# Altium schematic sheet EmgAcq.SchDoc: EMG ACQ-4
size A3
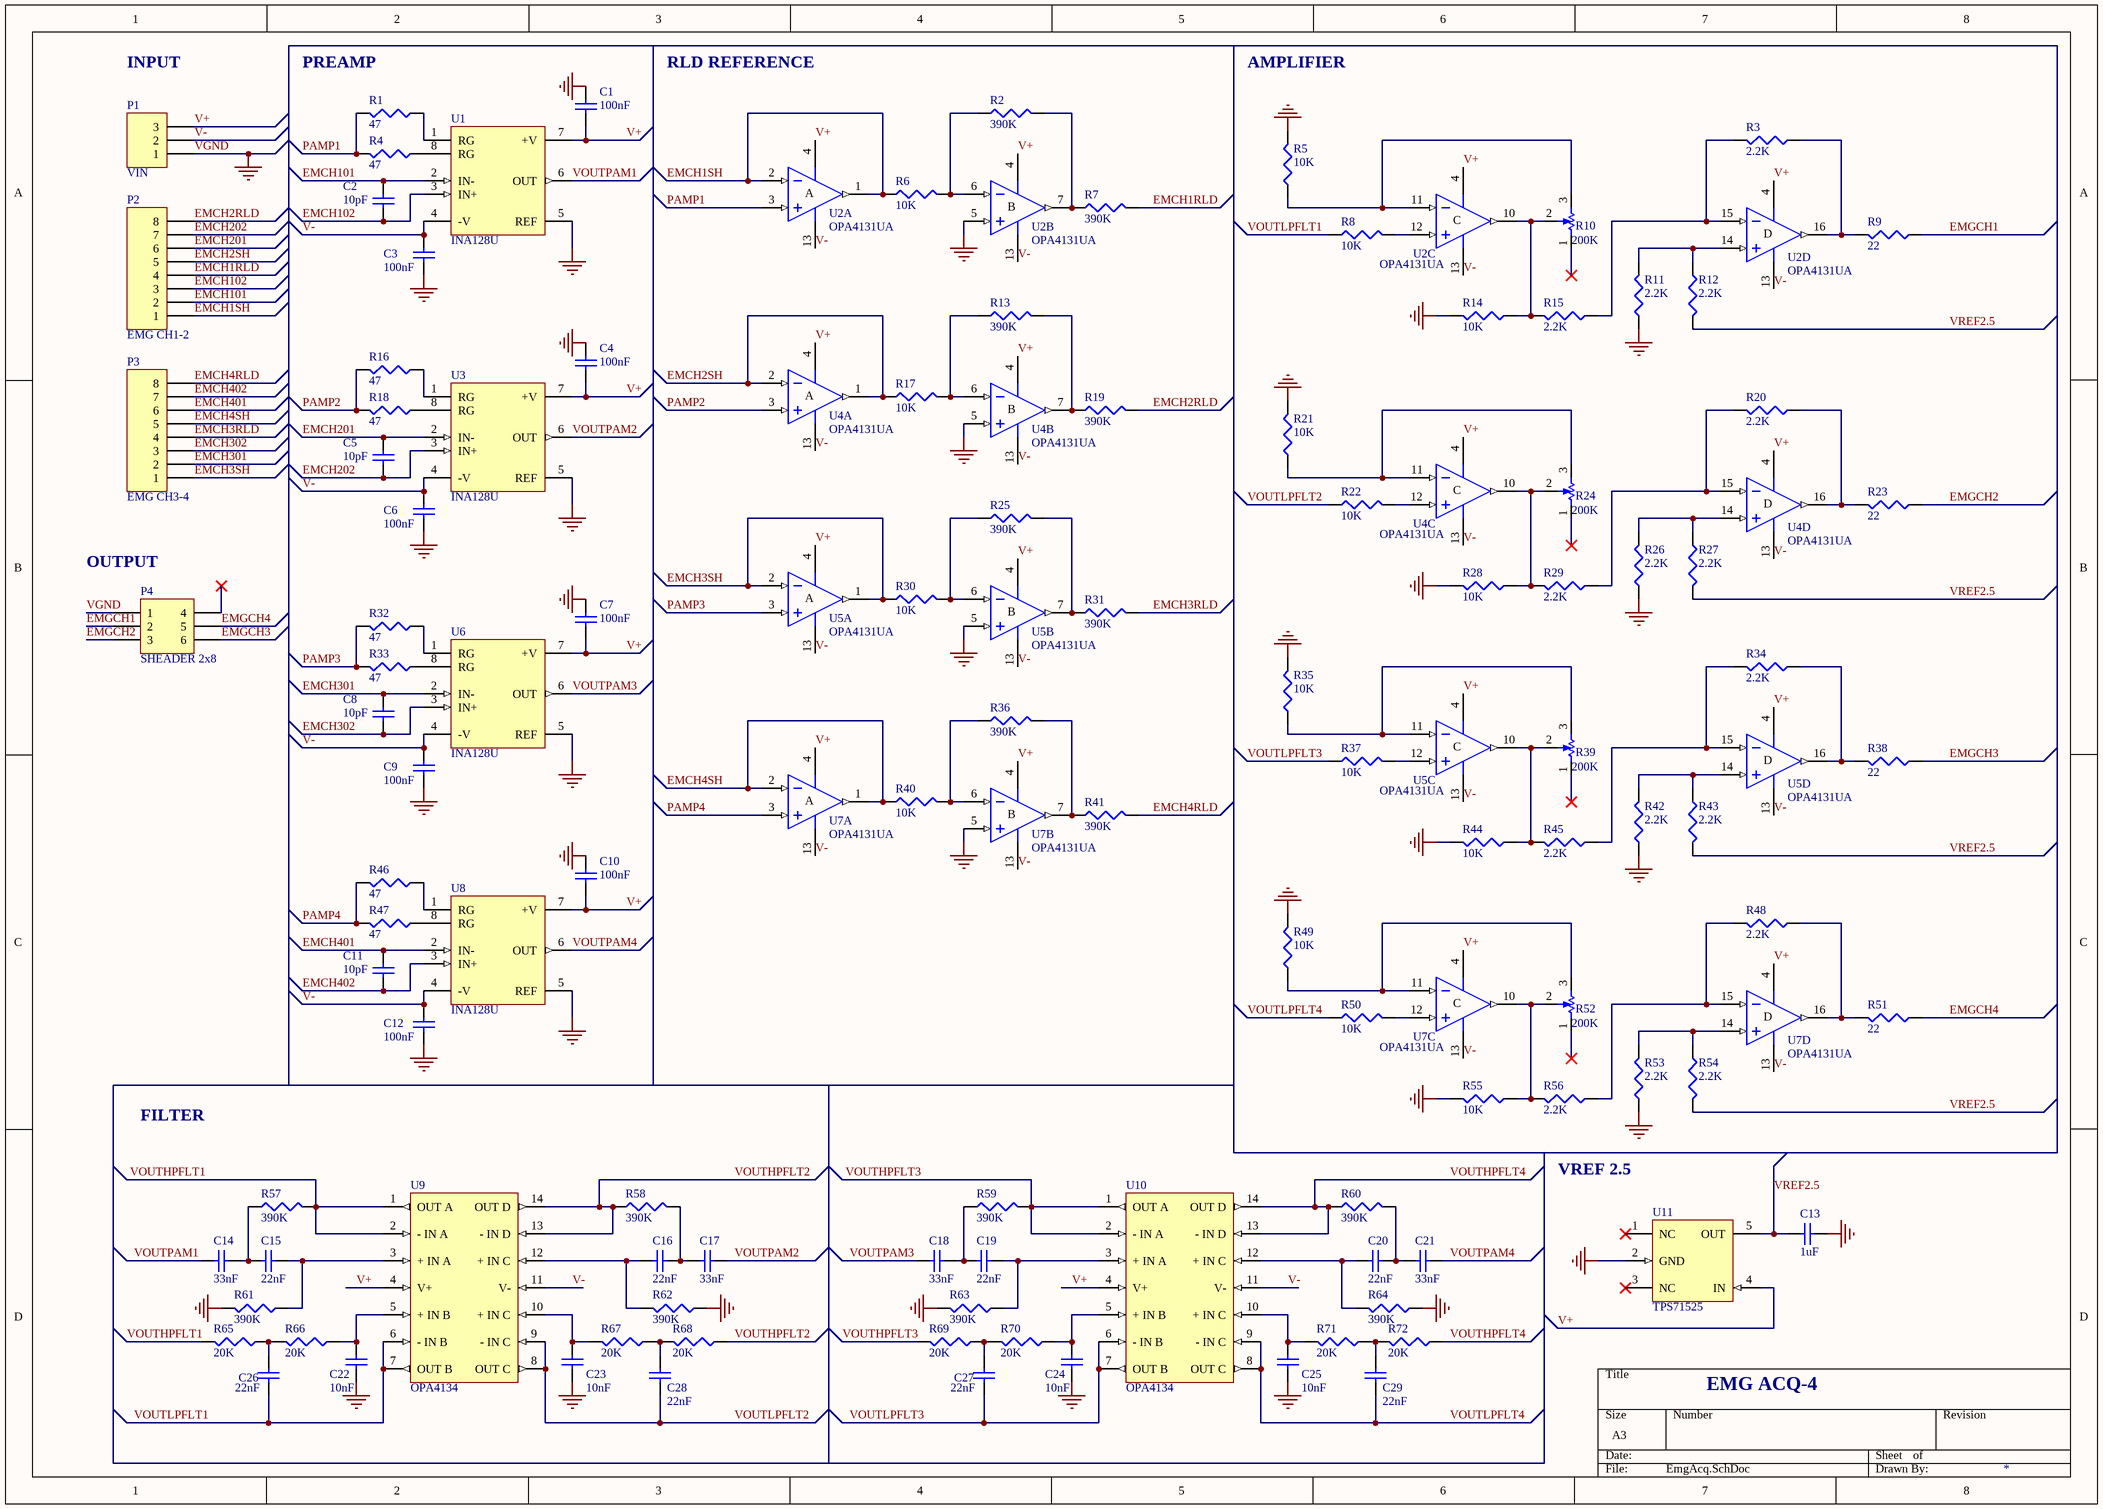
[diagram p0: EmgAcq.SchDoc]

## Parts
C1  value 100nF  [C1206]  (hidden comment: Cap Semi)
C2  value 10pF  [C1206]  (hidden comment: Cap Semi)
C3  value 100nF  [C1206]  (hidden comment: Cap Semi)
C4  value 100nF  [C1206]  (hidden comment: Cap Semi)
C5  value 10pF  [C1206]  (hidden comment: Cap Semi)
C6  value 100nF  [C1206]  (hidden comment: Cap Semi)
C7  value 100nF  [C1206]  (hidden comment: Cap Semi)
C8  value 10pF  [C1206]  (hidden comment: Cap Semi)
C9  value 100nF  [C1206]  (hidden comment: Cap Semi)
C10  value 100nF  [C1206]  (hidden comment: Cap Semi)
C11  value 10pF  [C1206]  (hidden comment: Cap Semi)
C12  value 100nF  [C1206]  (hidden comment: Cap Semi)
C13  value 1uF  [CAPC2012M]  (hidden comment: Cap Semi)
C14  value 33nF  [C1206]  (hidden comment: Cap Semi)
C15  value 22nF  [1608[0603]]  (hidden comment: Cap Semi)
C16  value 22nF  [1608[0603]]  (hidden comment: Cap Semi)
C17  value 33nF  [C1206]  (hidden comment: Cap Semi)
C18  value 33nF  [C1206]  (hidden comment: Cap Semi)
C19  value 22nF  [1608[0603]]  (hidden comment: Cap Semi)
C20  value 22nF  [1608[0603]]  (hidden comment: Cap Semi)
C21  value 33nF  [C1206]  (hidden comment: Cap Semi)
C22  value 10nF  [C1206]  (hidden comment: Cap Semi)
C23  value 10nF  [C1206]  (hidden comment: Cap Semi)
C24  value 10nF  [C1206]  (hidden comment: Cap Semi)
C25  value 10nF  [C1206]  (hidden comment: Cap Semi)
C26  value 22nF  [1608[0603]]  (hidden comment: Cap Semi)
C27  value 22nF  [1608[0603]]  (hidden comment: Cap Semi)
C28  value 22nF  [1608[0603]]  (hidden comment: Cap Semi)
C29  value 22nF  [1608[0603]]  (hidden comment: Cap Semi)
P1  VIN  [AZUL5-3]
P2  EMG CH1-2  [AZUL5-8]
P3  EMG CH3-4  [AZUL5-8]
P4  SHEADER 2x8  [SHBH 2x3]
R1  value 47  [RESC3225M]  (hidden comment: Res3)
R2  value 390K  [RESC3225M]  (hidden comment: Res3)
R3  value 2.2K  [RESC3225M]  (hidden comment: Res3)
R4  value 47  [RESC3225M]  (hidden comment: Res3)
R5  value 10K  [RESC3225M]  (hidden comment: Res3)
R6  value 10K  [RESC3225M]  (hidden comment: Res3)
R7  value 390K  [RESC3225M]  (hidden comment: Res3)
R8  value 10K  [RESC3225M]  (hidden comment: Res3)
R9  value 22  [RESC3225M]  (hidden comment: Res3)
R10  POT3361  [3361P]  (value not drawn)
R11  value 2.2K  [RESC3225M]  (hidden comment: Res3)
R12  value 2.2K  [RESC3225M]  (hidden comment: Res3)
R13  value 390K  [RESC3225M]  (hidden comment: Res3)
R14  value 10K  [RESC3225M]  (hidden comment: Res3)
R15  value 2.2K  [RESC3225M]  (hidden comment: Res3)
R16  value 47  [RESC3225M]  (hidden comment: Res3)
R17  value 10K  [RESC3225M]  (hidden comment: Res3)
R18  value 47  [RESC3225M]  (hidden comment: Res3)
R19  value 390K  [RESC3225M]  (hidden comment: Res3)
R20  value 2.2K  [RESC3225M]  (hidden comment: Res3)
R21  value 10K  [RESC3225M]  (hidden comment: Res3)
R22  value 10K  [RESC3225M]  (hidden comment: Res3)
R23  value 22  [RESC3225M]  (hidden comment: Res3)
R24  POT3361  [3361P]  (value not drawn)
R25  value 390K  [RESC3225M]  (hidden comment: Res3)
R26  value 2.2K  [RESC3225M]  (hidden comment: Res3)
R27  value 2.2K  [RESC3225M]  (hidden comment: Res3)
R28  value 10K  [RESC3225M]  (hidden comment: Res3)
R29  value 2.2K  [RESC3225M]  (hidden comment: Res3)
R30  value 10K  [RESC3225M]  (hidden comment: Res3)
R31  value 390K  [RESC3225M]  (hidden comment: Res3)
R32  value 47  [RESC3225M]  (hidden comment: Res3)
R33  value 47  [RESC3225M]  (hidden comment: Res3)
R34  value 2.2K  [RESC3225M]  (hidden comment: Res3)
R35  value 10K  [RESC3225M]  (hidden comment: Res3)
R36  value 390K  [RESC3225M]  (hidden comment: Res3)
R37  value 10K  [RESC3225M]  (hidden comment: Res3)
R38  value 22  [RESC3225M]  (hidden comment: Res3)
R39  POT3361  [3361P]  (value not drawn)
R40  value 10K  [RESC3225M]  (hidden comment: Res3)
R41  value 390K  [RESC3225M]  (hidden comment: Res3)
R42  value 2.2K  [RESC3225M]  (hidden comment: Res3)
R43  value 2.2K  [RESC3225M]  (hidden comment: Res3)
R44  value 10K  [RESC3225M]  (hidden comment: Res3)
R45  value 2.2K  [RESC3225M]  (hidden comment: Res3)
R46  value 47  [RESC3225M]  (hidden comment: Res3)
R47  value 47  [RESC3225M]  (hidden comment: Res3)
R48  value 2.2K  [RESC3225M]  (hidden comment: Res3)
R49  value 10K  [RESC3225M]  (hidden comment: Res3)
R50  value 10K  [RESC3225M]  (hidden comment: Res3)
R51  value 22  [RESC3225M]  (hidden comment: Res3)
R52  POT3361  [3361P]  (value not drawn)
R53  value 2.2K  [RESC3225M]  (hidden comment: Res3)
R54  value 2.2K  [RESC3225M]  (hidden comment: Res3)
R55  value 10K  [RESC3225M]  (hidden comment: Res3)
R56  value 2.2K  [RESC3225M]  (hidden comment: Res3)
R57  value 390K  [RESC3225M]  (hidden comment: Res3)
R58  value 390K  [RESC3225M]  (hidden comment: Res3)
R59  value 390K  [RESC3225M]  (hidden comment: Res3)
R60  value 390K  [RESC3225M]  (hidden comment: Res3)
R61  value 390K  [RESC3225M]  (hidden comment: Res3)
R62  value 390K  [RESC3225M]  (hidden comment: Res3)
R63  value 390K  [RESC3225M]  (hidden comment: Res3)
R64  value 390K  [RESC3225M]  (hidden comment: Res3)
R65  value 20K  [RESC3225M]  (hidden comment: Res3)
R66  value 20K  [RESC3225M]  (hidden comment: Res3)
R67  value 20K  [RESC3225M]  (hidden comment: Res3)
R68  value 20K  [RESC3225M]  (hidden comment: Res3)
R69  value 20K  [RESC3225M]  (hidden comment: Res3)
R70  value 20K  [RESC3225M]  (hidden comment: Res3)
R71  value 20K  [RESC3225M]  (hidden comment: Res3)
R72  value 20K  [RESC3225M]  (hidden comment: Res3)
U1  INA128U  [182H_N]
U2  OPA4131UA  [211F_N]  (parts A,B,C,D of 4)
U3  INA128U  [182H_N]
U4  OPA4131UA  [211F_N]  (parts A,B,C,D of 4)
U5  OPA4131UA  [211F_N]  (parts A,B,C,D of 4)
U6  INA128U  [182H_N]
U7  OPA4131UA  [211F_N]  (parts A,B,C,D of 4)
U8  INA128U  [182H_N]
U9  OPA4134  [SOIC127P600-14M]
U10  OPA4134  [SOIC127P600-14M]
U11  TPS71525  [SOT353-5L]

## Nets
VGND: C1.2 C3.1 C4.2 C6.1 C7.2 C9.1 C10.2 C12.1 C13.2 C22.1 C23.1 C24.1 C25.1 P1.1 P4.1 R5.1 R11.2 R14.1 R21.1 R26.2 R28.1 R35.1 R42.2 R44.1 R49.1 R53.2 R55.1 R61.2 R62.2 R63.2 R64.2 U1.5(REF) U2.5(IN+) U3.5(REF) U4.5(IN+) U5.5(IN+) U6.5(REF) U7.5(IN+) U8.5(REF) U11.2(GND)  [also labelled GND]
EMCH1RLD: P2.4 R7.2
EMCH1SH: P2.1 R6.1 U2.1(OUT) U2.2(IN-)
EMCH2RLD: P2.8 R19.2
EMCH2SH: P2.5 R17.1 U4.1(OUT) U4.2(IN-)
EMCH3RLD: P3.4 R31.2
EMCH3SH: P3.1 R30.1 U5.1(OUT) U5.2(IN-)
EMCH4RLD: P3.8 R41.2
EMCH4SH: P3.5 R40.1 U7.1(OUT) U7.2(IN-)
EMCH101: C2.2 P2.2 U1.2(IN-)
EMCH102: C2.1 P2.3 U1.3(IN+)
EMCH201: C5.2 P2.6 U3.2(IN-)
EMCH202: C5.1 P2.7 U3.3(IN+)
EMCH301: C8.2 P3.2 U6.2(IN-)
EMCH302: C8.1 P3.3 U6.3(IN+)
EMCH401: C11.2 P3.6 U8.2(IN-)
EMCH402: C11.1 P3.7 U8.3(IN+)
EMGCH1: P4.2 R9.2
EMGCH2: P4.3 R23.2
EMGCH3: P4.6 R38.2
EMGCH4: P4.5 R51.2
PAMP1: R1.2 R4.2 U2.3(IN+)
PAMP2: R16.2 R18.2 U4.3(IN+)
PAMP3: R32.2 R33.2 U5.3(IN+)
PAMP4: R46.2 R47.2 U7.3(IN+)
V+: C1.1 C4.1 C7.1 C10.1 P1.3 U1.7(+V) U2.4(V+) U3.7(+V) U4.4(V+) U5.4(V+) U6.7(+V) U7.4(V+) U8.7(+V) U9.4(V+) U10.4(V+) U11.4(IN)
V-: C3.2 C6.2 C9.2 C12.2 P1.2 U1.4(-V) U2.13(V-) U3.4(-V) U4.13(V-) U5.13(V-) U6.4(-V) U7.13(V-) U8.4(-V) U9.11(V-) U10.11(V-)
VOUTHPFLT1: R57.2 R65.2 U9.1(OUT_A) U9.2(-_IN_A)
VOUTHPFLT2: R58.2 R68.2 U9.13(-_IN_D) U9.14(OUT_D)
VOUTHPFLT3: R59.2 R69.2 U10.1(OUT_A) U10.2(-_IN_A)
VOUTHPFLT4: R60.2 R72.2 U10.13(-_IN_D) U10.14(OUT_D)
VOUTLPFLT1: C26.1 R8.2 U9.6(-_IN_B) U9.7(OUT_B)
VOUTLPFLT2: C28.1 R22.2 U9.8(OUT_C) U9.9(-_IN_C)
VOUTLPFLT3: C27.1 R37.2 U10.6(-_IN_B) U10.7(OUT_B)
VOUTLPFLT4: C29.1 R50.2 U10.8(OUT_C) U10.9(-_IN_C)
VOUTPAM1: C14.2 U1.6(OUT)
VOUTPAM2: C17.2 U3.6(OUT)
VOUTPAM3: C18.2 U6.6(OUT)
VOUTPAM4: C21.2 U8.6(OUT)
VREF2.5: C13.1 R12.1 R27.1 R43.1 R54.1 U11.5(OUT)
NetC14_1: C14.1 C15.2 R57.1
NetC15_1: C15.1 R61.1 U9.3(+_IN_A)
NetC16_1: C16.1 R62.1 U9.12(+_IN_C)
NetC16_2: C16.2 C17.1 R58.1
NetC18_1: C18.1 C19.2 R59.1
NetC19_1: C19.1 R63.1 U10.3(+_IN_A)
NetC20_1: C20.1 R64.1 U10.12(+_IN_C)
NetC20_2: C20.2 C21.1 R60.1
NetC22_2: C22.2 R66.1 U9.5(+_IN_B)
NetC23_2: C23.2 R67.1 U9.10(+_IN_C)
NetC24_2: C24.2 R70.1 U10.5(+_IN_B)
NetC25_2: C25.2 R71.1 U10.10(+_IN_C)
NetC26_2: C26.2 R65.1 R66.2
NetC27_2: C27.2 R69.1 R70.2
NetC28_2: C28.2 R67.2 R68.1
NetC29_2: C29.2 R71.2 R72.1
NetR1_1: R1.1 U1.1(RG)
NetR2_1: R2.1 R6.2 U2.6(IN-)
NetR2_2: R2.2 R7.1 U2.7(OUT)
NetR3_1: R3.1 R15.2 U2.15(IN-)
NetR3_2: R3.2 R9.1 U2.16(OUT)
NetR4_1: R4.1 U1.8(RG)
NetR5_2: R5.2 R10.3 U2.11(IN-)
NetR8_1: R8.1 U2.12(IN+)
NetR10_2: R10.2 R14.2 R15.1 U2.10(OUT)
NetR11_1: R11.1 R12.2 U2.14(IN+)
NetR13_1: R13.1 R17.2 U4.6(IN-)
NetR13_2: R13.2 R19.1 U4.7(OUT)
NetR16_1: R16.1 U3.1(RG)
NetR18_1: R18.1 U3.8(RG)
NetR20_1: R20.1 R29.2 U4.15(IN-)
NetR20_2: R20.2 R23.1 U4.16(OUT)
NetR21_2: R21.2 R24.3 U4.11(IN-)
NetR22_1: R22.1 U4.12(IN+)
NetR24_2: R24.2 R28.2 R29.1 U4.10(OUT)
NetR25_1: R25.1 R30.2 U5.6(IN-)
NetR25_2: R25.2 R31.1 U5.7(OUT)
NetR26_1: R26.1 R27.2 U4.14(IN+)
NetR32_1: R32.1 U6.1(RG)
NetR33_1: R33.1 U6.8(RG)
NetR34_1: R34.1 R45.2 U5.15(IN-)
NetR34_2: R34.2 R38.1 U5.16(OUT)
NetR35_2: R35.2 R39.3 U5.11(IN-)
NetR36_1: R36.1 R40.2 U7.6(IN-)
NetR36_2: R36.2 R41.1 U7.7(OUT)
NetR37_1: R37.1 U5.12(IN+)
NetR39_2: R39.2 R44.2 R45.1 U5.10(OUT)
NetR42_1: R42.1 R43.2 U5.14(IN+)
NetR46_1: R46.1 U8.1(RG)
NetR47_1: R47.1 U8.8(RG)
NetR48_1: R48.1 R56.2 U7.15(IN-)
NetR48_2: R48.2 R51.1 U7.16(OUT)
NetR49_2: R49.2 R52.3 U7.11(IN-)
NetR50_1: R50.1 U7.12(IN+)
NetR52_2: R52.2 R55.2 R56.1 U7.10(OUT)
NetR53_1: R53.1 R54.2 U7.14(IN+)

Not connected (* = marked no-connect by the designer): P4 4*; R10 1*; R24 1*; R39 1*; R52 1*; U11 1(NC)* 3(NC)*

## Notes on the sheet
- INPUT
- (near R1) PREAMP
- RLD REFERENCE
- AMPLIFIER
- (near P4) OUTPUT
- FILTER
- VREF 2.5
- (in symbol OPA4131UA, part A) A
- (in symbol OPA4131UA, part B) B
- (in symbol OPA4131UA, part C) C
- (in symbol OPA4131UA, part D) D
- (in symbol POT3361) 200K

## Library data of the parts
C1-C29 = Cap Semi: Capacitor (Semiconductor SIM Model); Published: 8-Jun-2000; LatestRevisionDate: 29-May-2009; LatestRevisionNote: IPC-7351 Footprint Added.; PackageReference: C1206; Publisher: Altium Limited; PackageDescription: Chip Capacitor
P1 = Header 3: Header, 3-Pin; LatestRevisionDate: 17-Jul-2002; LatestRevisionNote: Re-released for DXP Platform.; Publisher: Altium Limited
P2 P3 = Header 8: Header, 8-Pin; LatestRevisionDate: 17-Jul-2002; LatestRevisionNote: Re-released for DXP Platform.; Publisher: Altium Limited
P4 = SB Header 2x3: Shrouded Box Header: 2x8-Pin, 0.100" (2.54 mm) Male
R1-R9 R11-R23 R25-R38 R40-R51 R53-R72 = Res3: Resistor; Published: 8-Jun-2000; LatestRevisionDate: 29-May-2009; LatestRevisionNote: IPC-7351 Footprint Added.; PackageReference: J1-0603; Publisher: Altium Limited; PackageDescription: Chip Resistor
U1 U3 U6 U8 = INA128U: Precision, Low-Power Instrumentation Amplifiers; Published: 8-Jun-2000; LatestRevisionDate: 13-Apr-2006; LatestRevisionNote: IPC-7351 Footprint Added.; DatasheetVersion: Oct-1996; PackageReference: 182H; Publisher: Altium Limited; PackageDescription: 8-Pin Small Outline Integrated Circuit 1.27 mm Pitch; Code_JEDEC: MS-012-AA; Code_IPC: SOIC127P600-8; ComponentLink1Description: Manufacturer Link; ComponentLink1URL: http://www.ti.com/; ComponentLink2Description: Datasheet; ComponentLink2URL: http://www-s.ti.com/sc/ds/INA128.pdf
U2 U4 U5 U7 = OPA4131UA: General Purpose FET-Input Operational Amplifiers; Note: Pins 8 and 9 are No internal Connection (NC) pins and are not drawn.; Published: 8-Jun-2000; LatestRevisionDate: 13-Apr-2006; LatestRevisionNote: IPC-7351 Footprint Added.; DatasheetVersion: Jan-1996; PackageReference: 211F; Publisher: Altium Limited; PackageDescription: 16-Pin Small Outline Integrated Circuit 1.27 mm Pitch; Code_JEDEC: MS-013-AA; Code_IPC: SOIC127P1030-16; ComponentLink1Description: Manufacturer Link; ComponentLink1URL: http://www.ti.com/; ComponentLink2Description: Datasheet; ComponentLink2URL: http://www-s.ti.com/sc/ds/OPA131.pdf